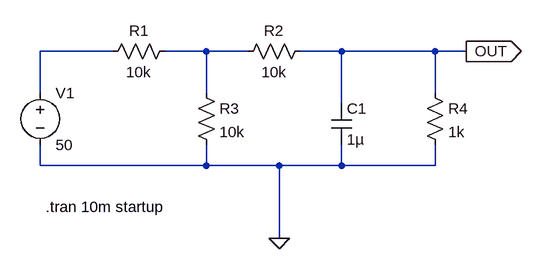
[diagram p0: schematic Practice Work 2.asc]
Practice Work 2.asc, the LTspice schematic file:
Version 4
SHEET 1 880 680
WIRE 32 144 -80 144
WIRE 176 144 112 144
WIRE 240 144 176 144
WIRE 384 144 320 144
WIRE 528 144 384 144
WIRE 576 144 528 144
WIRE -80 208 -80 144
WIRE 176 208 176 144
WIRE 528 208 528 144
WIRE 384 224 384 144
WIRE -80 320 -80 288
WIRE 176 320 176 288
WIRE 176 320 -80 320
WIRE 288 320 176 320
WIRE 384 320 384 288
WIRE 384 320 288 320
WIRE 528 320 528 288
WIRE 528 320 384 320
WIRE 288 432 288 320
FLAG 288 432 0
FLAG 576 144 OUT
IOPIN 576 144 Out
SYMBOL res 16 160 R270
WINDOW 0 32 56 VTop 2
WINDOW 3 0 56 VBottom 2
SYMATTR InstName R1
SYMATTR Value 10k
SYMBOL res 224 160 R270
WINDOW 0 32 56 VTop 2
WINDOW 3 0 56 VBottom 2
SYMATTR InstName R2
SYMATTR Value 10k
SYMBOL res 160 192 R0
SYMATTR InstName R3
SYMATTR Value 10k
SYMBOL res 512 192 R0
SYMATTR InstName R4
SYMATTR Value 1k
SYMBOL cap 368 224 R0
SYMATTR InstName C1
SYMATTR Value 1µ
SYMBOL voltage -80 192 R0
WINDOW 123 0 0 Left 0
WINDOW 39 0 0 Left 0
SYMATTR InstName V1
SYMATTR Value 50
TEXT -72 384 Left 2 !.tran 10m startup

The netlist it stands for:
* Practice Work 2.asc
R1 N001 N002 10k
R2 N002 OUT 10k
R3 N002 0 10k
R4 OUT 0 1k
C1 OUT 0 1µ
V1 N001 0 50
.tran 10m startup
.backanno
.end